# Altium project BY-IOM-v0.2.PrjPCB
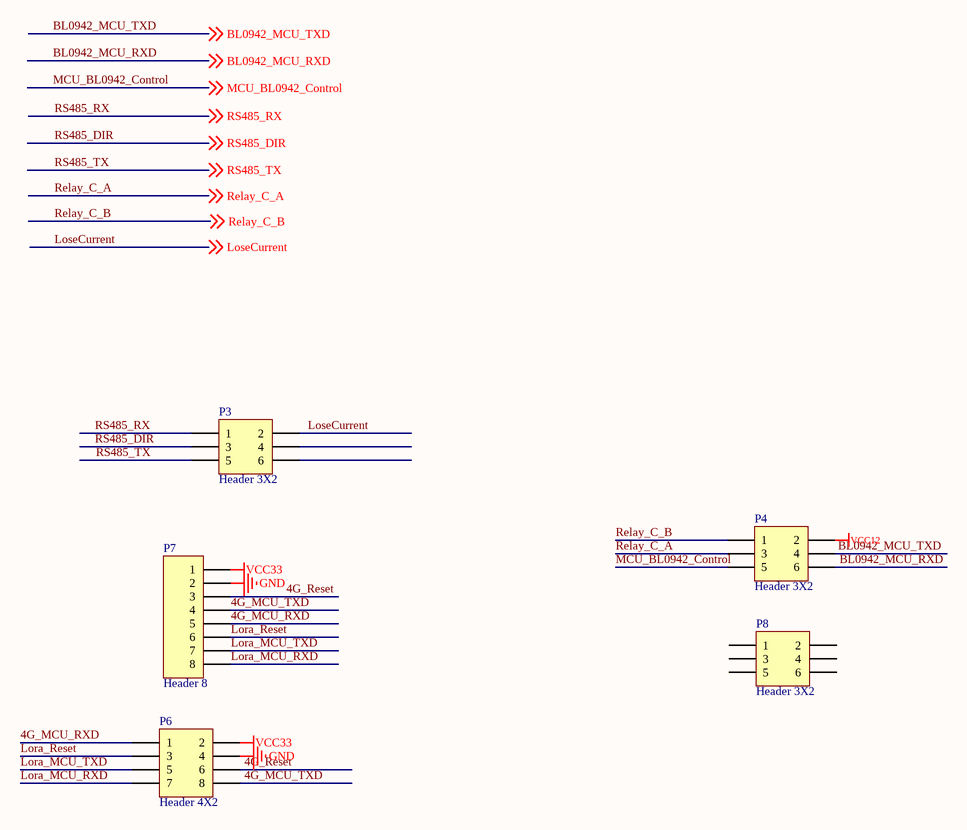
[diagram p0: 连接.SchDoc]
3 sheets, 60 parts. Net scope: global (net labels, ports and power ports of the same name join across sheets).
Board file: Power.PcbDoc
Sheets:
  连接.SchDoc
  计量.SchDoc
  漏电流检测.SchDoc

## Sheet 连接.SchDoc
size A

### Parts
P3  Header 3X2  [CONN-SMD_5BME8-08872-203-W0]
P4  Header 3X2  [CONN-SMD_5BME8-08872-203-W0]
P6  Header 4X2  [CONN-SMD_5BME8-08872-204-W0]
P7  Header 8  [HDR1X8]
P8  Header 3X2  [CONN-SMD_5BME8-08872-203-W0]

### Nets
GND: P6.4 P7.2
VCC12: P4.2
VCC33: P6.2 P7.1
4G_MCU_RXD: P6.1 P7.5
4G_MCU_TXD: P6.8 P7.4
4G_Reset: P6.6 P7.3
BL0942_MCU_RXD: P4.6 ; off-sheet BL0942_MCU_RXD
BL0942_MCU_TXD: P4.4 ; off-sheet BL0942_MCU_TXD
Lora_MCU_RXD: P6.7 P7.8
Lora_MCU_TXD: P6.5 P7.7
Lora_Reset: P6.3 P7.6
LoseCurrent: P3.2 ; off-sheet LoseCurrent
MCU_BL0942_Control: P4.5 ; off-sheet MCU_BL0942_Control
Relay_C_A: P4.3 ; off-sheet Relay_C_A
Relay_C_B: P4.1 ; off-sheet Relay_C_B
RS485_DIR: P3.3 ; off-sheet RS485_DIR
RS485_RX: P3.1 ; off-sheet RS485_RX
RS485_TX: P3.5 ; off-sheet RS485_TX

Not connected (* = marked no-connect by the designer): P3 4 6; P8 1 2 3 4 5 6

### Library data of the parts
P3 P4 P8 = Header 3X2: Header, 3-Pin, Dual row; LatestRevisionDate: 17-Jul-2002; LatestRevisionNote: Re-released for DXP Platform.; Publisher: Altium Limited
P6 = Header 4X2: Header, 4-Pin, Dual row; LatestRevisionDate: 17-Jul-2002; LatestRevisionNote: Re-released for DXP Platform.; Publisher: Altium Limited
P7 = Header 8: Header, 8-Pin; LatestRevisionDate: 17-Jul-2002; LatestRevisionNote: Re-released for DXP Platform.; Publisher: Altium Limited

## Sheet 计量.SchDoc
size A4
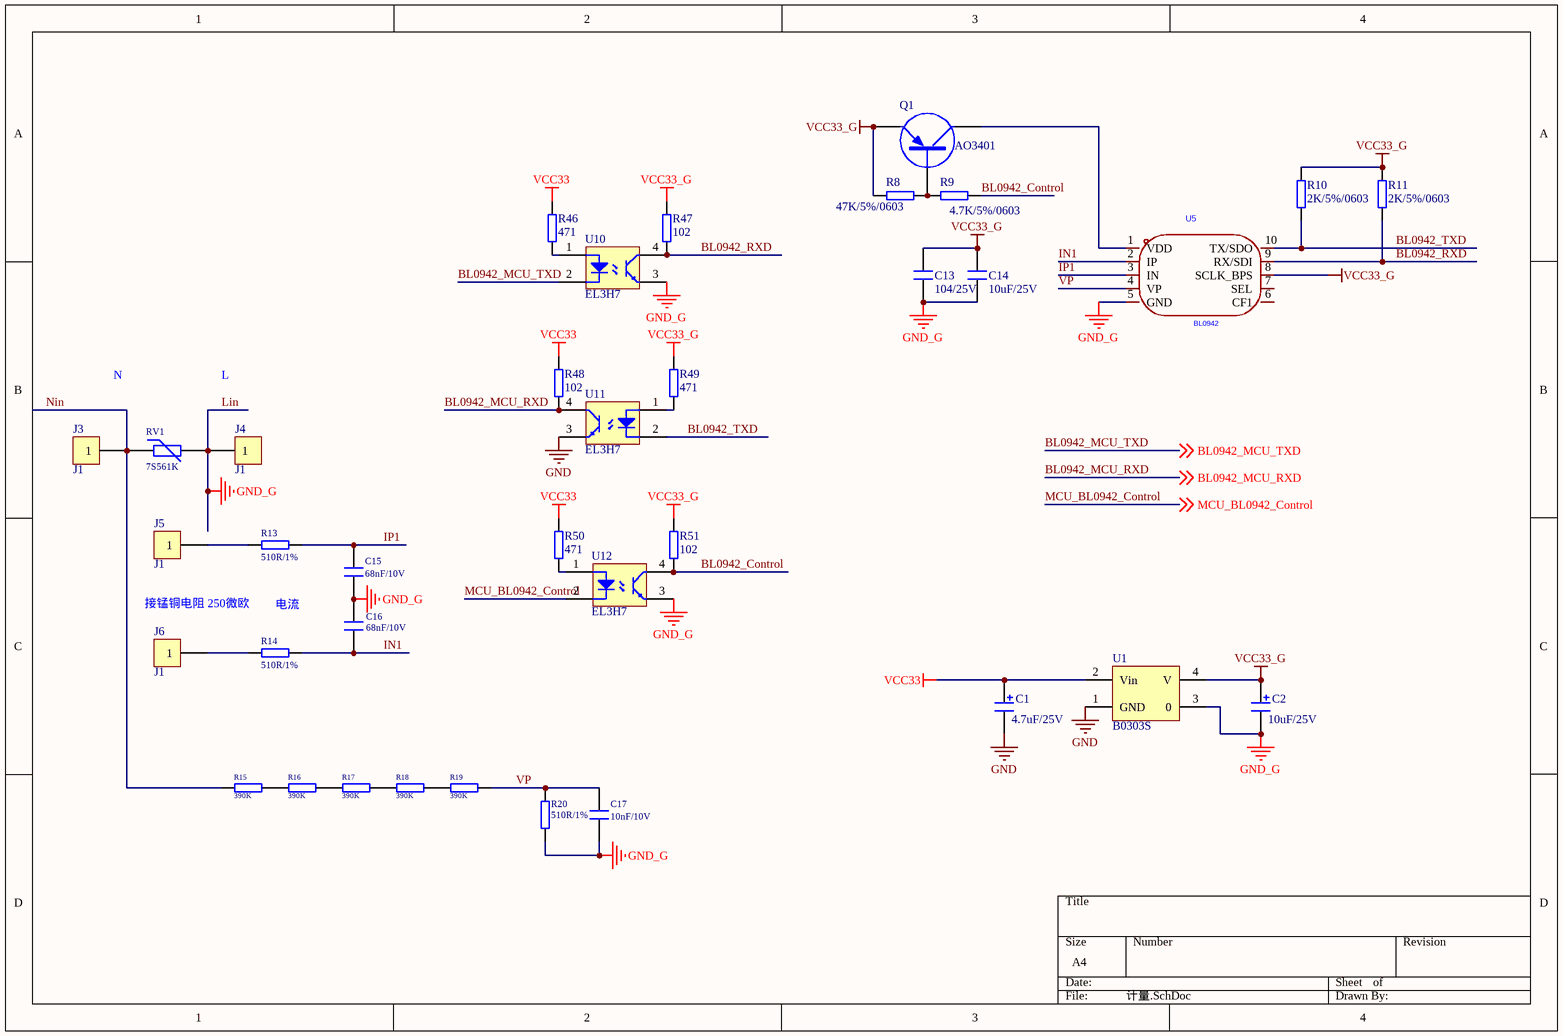
[diagram p1: 计量.SchDoc]

### Parts
C1  4.7uF/25V  [0805R]
C2  10uF/25V  [0805R]
C13  104/25V  [0603R]
C14  10uF/25V  [0603R]
C15  68nF/10V  [0603R]
C16  68nF/10V  [0603R]
C17  10nF/10V  [0603R]
J3  J1  [贴片焊盘V1（3*2椭圆）]
J4  J1  [贴片焊盘V1（3*2椭圆）]
J5  J1  [贴片焊盘V1（3*2椭圆）]
J6  J1  [贴片焊盘V1（3*2椭圆）]
Q1  AO3401  [SOT-23]
R8  47K/5%/0603  [0603R]
R9  4.7K/5%/0603  [0603R]
R10  2K/5%/0603  [0603R]
R11  2K/5%/0603  [0603R]
R13  510R/1%  [0603R]
R14  510R/1%  [0603R]
R15  390K  [0805R]
R16  390K  [0805R]
R17  390K  [0805R]
R18  390K  [0805R]
R19  390K  [0805R]
R20  510R/1%  [0603R]
R46  471  [0603R]
R47  102  [0603R]
R48  102  [0603R]
R49  471  [0603R]
R50  471  [0603R]
R51  102  [0603R]
RV1  7S561K  [10D821K]
U1  B0303S  [B1205S-1WR3]
U5  BL0942  [BL0942-10pin]
U10  EL3H7  [EL3H7]
U11  EL3H7  [EL3H7]
U12  EL3H7  [EL3H7]

### Nets
GND: C1.2 U1.1(GND) U11.3(E)
Lin: C2.2 C13.1 C14.1 C15.2 C16.2 C17.2 J4.1 R20.1 RV1.2 U1.3(0) U5.5(GND) U10.3(E) U12.3(E)  [also labelled GND_G]
VCC33: C1.1 R46.1 R48.2 R50.1 U1.2(Vin)
VCC33_G: C2.1 C13.2 C14.2 Q1.2(E) R8.2 R10.2 R11.2 R47.2 R49.1 R51.2 U1.4(V) U5.8(SCLK_BPS)
BL0942_Control: R9.2 R51.1 U12.4(C)
BL0942_MCU_RXD: R48.1 U11.4(C) ; off-sheet BL0942_MCU_RXD
BL0942_MCU_TXD: U10.2(K) ; off-sheet BL0942_MCU_TXD
BL0942_RXD: R11.1 R47.1 U5.9(RX/SDI) U10.4(C)
BL0942_TXD: R10.1 U5.10(TX/SDO) U11.2(K)
IN1: C16.1 R14.2 U5.2(IP)
IP1: C15.1 R13.2 U5.3(IN)
MCU_BL0942_Control: U12.2(K) ; off-sheet MCU_BL0942_Control
Nin: J3.1 R15.2 RV1.1
VP: C17.1 R19.1 R20.2 U5.4(VP)
NetJ5_1: J5.1 R13.1
NetJ6_1: J6.1 R14.1
NetQ1_1: Q1.1(B) R8.1 R9.1
NetQ1_3: Q1.3(C) U5.1(VDD)
NetR15_1: R15.1 R16.2
NetR16_1: R16.1 R17.2
NetR17_1: R17.1 R18.2
NetR18_1: R18.1 R19.2
NetR46_2: R46.2 U10.1(A)
NetR49_2: R49.2 U11.1(A)
NetR50_2: R50.2 U12.1(A)

Not connected (* = marked no-connect by the designer): U5 6(CF1) 7(SEL)

### Notes on the sheet
- N
- L
- 接锰铜电阻 250微欧
- 电流

### Library data of the parts
C1 C2 = CAP+
C13 C14 = CAP_1
C15-C17 = CAP
Q1 = PNP
R8-R11 R13-R20 R46-R51 = RES
RV1 = Res Varistor: Varistor (Voltage-Sensitive Resistor); Published: 24-Mar-1999; LatestRevisionDate: 29-May-2009; LatestRevisionNote: IPC-7351 Footprint Added.; PackageVersion: Mar-2003; PackageReference: 6-0805; Publisher: Altium Limited; PackageDescription: Chip Resistor 0805 Case Size; Code_IPC: RESC2012
U1 = B0505S
U5 = BL0942_C2837510: Manufacturer: BL(上海贝岭); Add into BOM: yes; Symbol: BL0942; Device: BL0942_C2837510; LCSC Part Name: BL0942内置时钟免校准计量芯片; Supplier Part: C2837510; Manufacturer Part: BL0942; Supplier Footprint: SSOP-10-150mil; JLCPCB Part Class: Extended Part; Datasheet: https://atta.szlcsc.com/upload/public/pdf/source/20220627/BFAD44701CA6DE9A8853C5A4834B6884.pdf; Supplier: LCSC; Convert to PCB: yes
U10-U12 = Optical_Coupler_1

## Sheet 漏电流检测.SchDoc
size A4
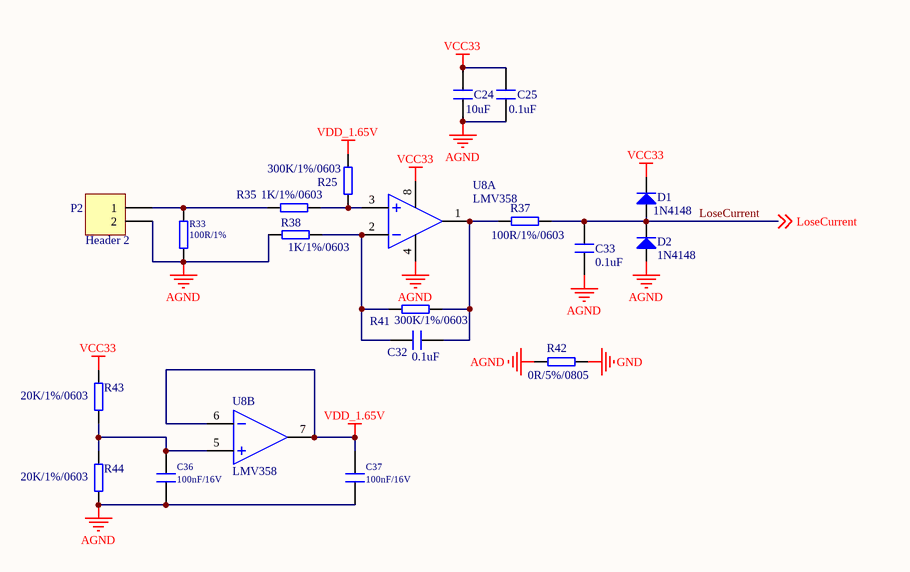
[diagram p2: 漏电流检测.SchDoc]

### Parts
C24  10uF  [0603R]
C25  0.1uF  [0603R]
C32  0.1uF  [0603R]
C33  0.1uF  [0603R]
C36  100nF/16V  [0603R]
C37  100nF/16V  [0603R]
D1  1N4148  [1206D]
D2  1N4148  [1206D]
P2  Header 2  [CONN-TH_P5.08_KF127-5.08-2P]
R25  300K/1%/0603  [0603r]
R33  100R/1%  [0805R]
R35  1K/1%/0603  [0603r]
R37  100R/1%/0603  [0603r]
R38  1K/1%/0603  [0603r]
R41  300K/1%/0603  [0603r]
R42  0R/5%/0805  [0805R]
R43  20K/1%/0603  [0603r]
R44  20K/1%/0603  [0603r]
U8  LMV358  [SO8]  (parts A,B of 2)

### Nets
AGND: C24.1 C25.1 C33.2 C36.2 C37.2 D2.2(A) P2.2 R33.1 R38.2 R42.2 R44.2 U8.4
GND: R42.1
VCC33: C24.2 C25.2 D1.1(K) R43.1 U8.8
VDD_1.65V: C37.1 R25.1 U8.6 U8.7
LoseCurrent: C33.1 D1.2(A) D2.1(K) R37.1 ; off-sheet LoseCurrent
NetC32_1: C32.1 R38.1 R41.2 U8.2
NetC32_2: C32.2 R37.2 R41.1 U8.1
NetC36_1: C36.1 R43.2 R44.1 U8.5
NetP2_1: P2.1 R33.2 R35.2
NetR25_2: R25.2 R35.1 U8.3

### Library data of the parts
C24 C25 C32 C33 C36 C37 = CAP
D1 D2 = DIODE
P2 = Header 2: Header, 2-Pin; LatestRevisionDate: 17-Jul-2002; LatestRevisionNote: Re-released for DXP Platform.; Publisher: Altium Limited
R25 R33 R35 R37 R38 R41-R44 = RES
U8 = LM358

## Nets that join several sheets
GND: 连接 (P6.4 P7.2), 计量 (C1.2 U1.1 U11.3), 漏电流检测 (R42.1)
VCC33: 连接 (P6.2 P7.1), 计量 (5 pins), 漏电流检测 (5 pins)
BL0942_MCU_RXD: 连接 (P4.6), 计量 (R48.1 U11.4)
BL0942_MCU_TXD: 连接 (P4.4), 计量 (U10.2)
LoseCurrent: 连接 (P3.2), 漏电流检测 (C33.1 D1.2 D2.1 R37.1)
MCU_BL0942_Control: 连接 (P4.5), 计量 (U12.2)